# EAGLE design Task10-1D (EAGLE 9.3.0)

## Sheet 1 of 5: Microcontroller
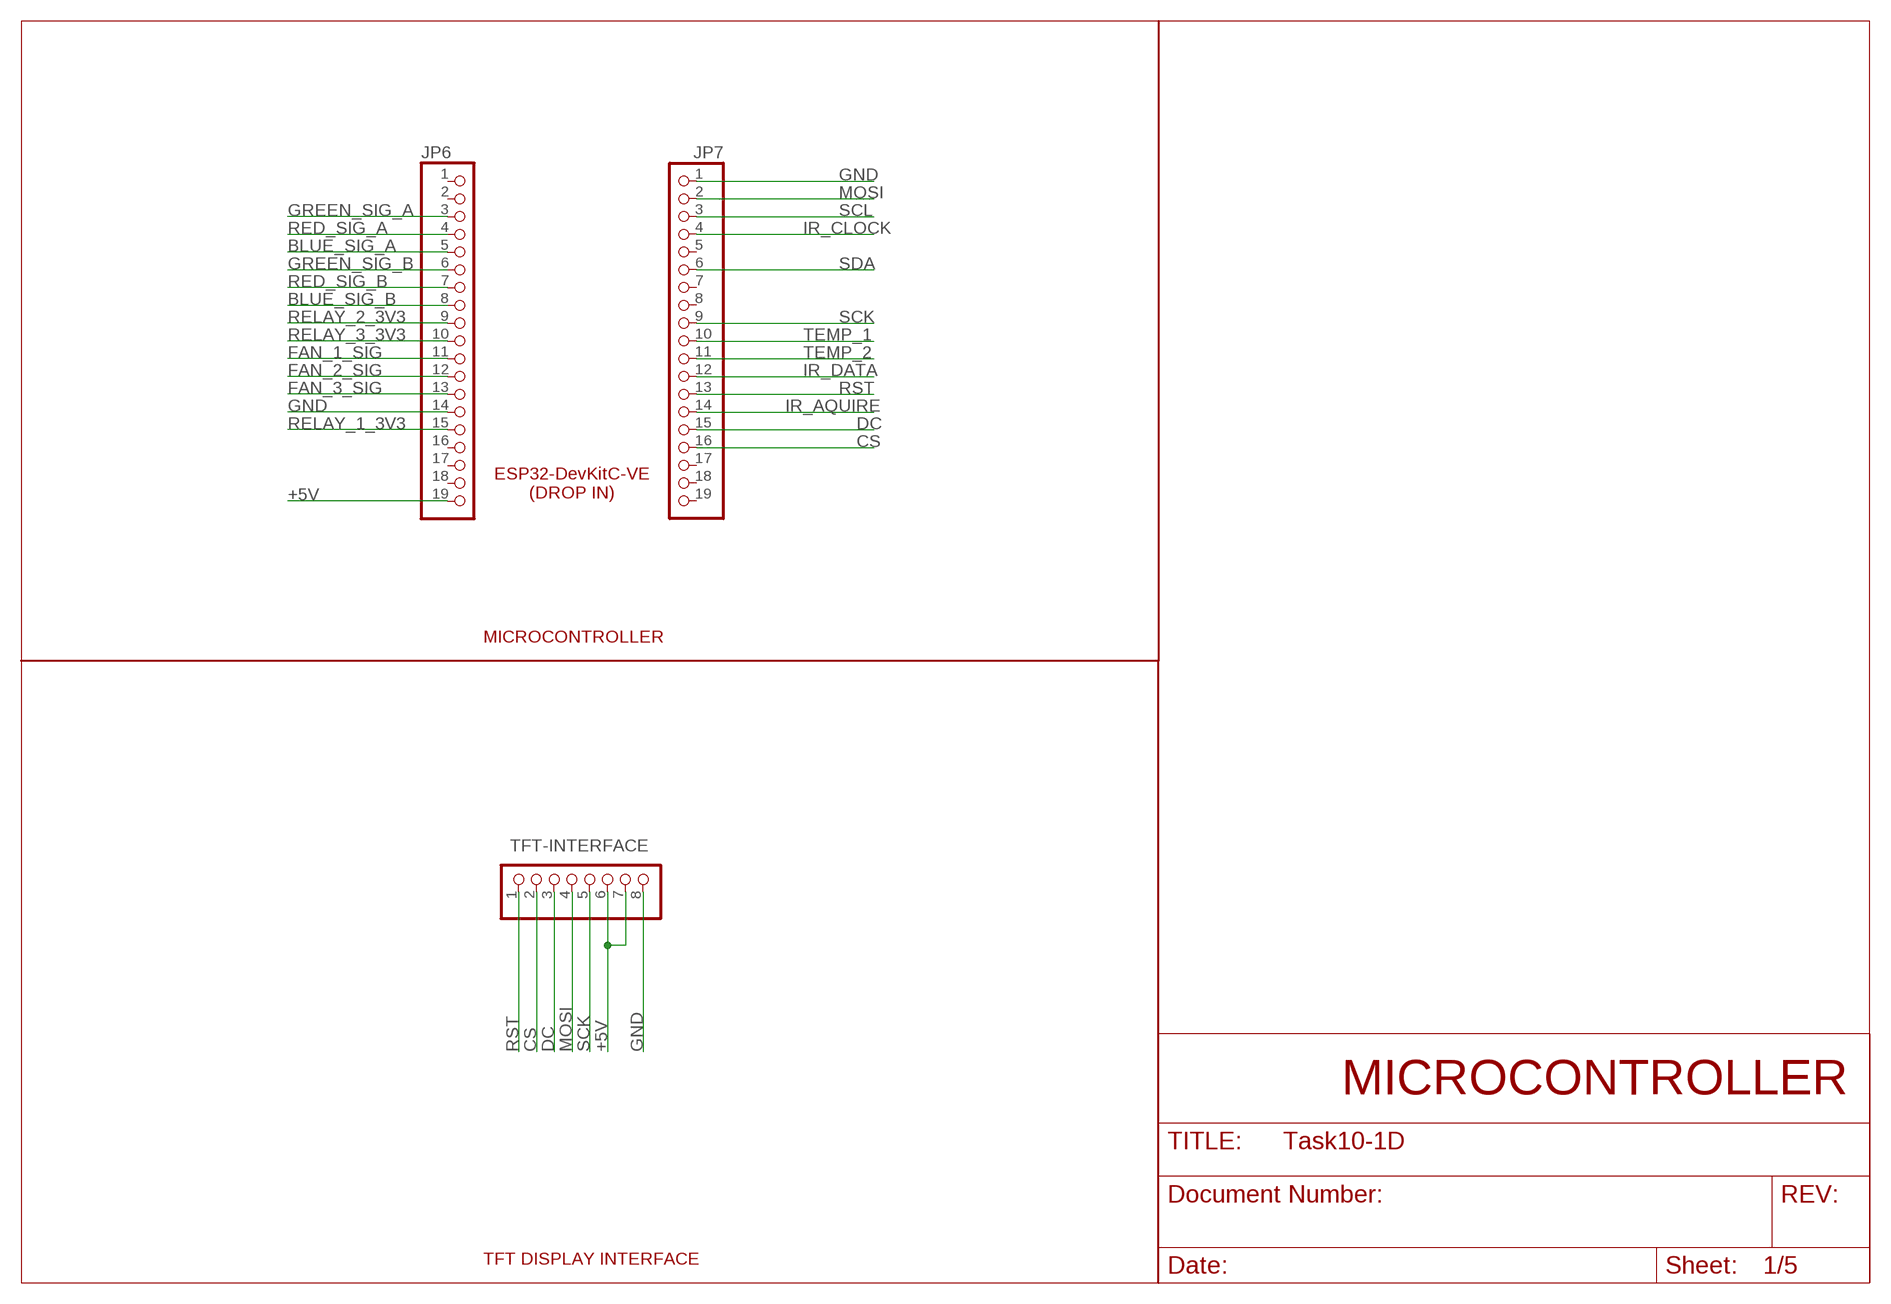
[diagram p0: schematic, sheet 1]

### Parts
JP6  PINHD-1X19  [1X19]
JP7  PINHD-1X19  [1X19]
TFT-INTERFACE  PINHD-1X8  [1X08]

### Nets
+5V: JP6.19 TFT-INTERFACE.6 TFT-INTERFACE.7 ; also sheet 2,5
BLUE_SIG_A: JP6.5 ; also sheet 4
BLUE_SIG_B: JP6.8 ; also sheet 4
CS: JP7.16 TFT-INTERFACE.2
DC: JP7.15 TFT-INTERFACE.3
FAN_1_SIG: JP6.11 ; also sheet 4
FAN_2_SIG: JP6.12 ; also sheet 4
FAN_3_SIG: JP6.13 ; also sheet 4
GND: JP6.14 JP7.1 TFT-INTERFACE.8 ; also sheet 2,3,4,5
GREEN_SIG_A: JP6.3 ; also sheet 4
GREEN_SIG_B: JP6.6 ; also sheet 4
IR_AQUIRE: JP7.14 ; also sheet 3
IR_CLOCK: JP7.4 ; also sheet 3
IR_DATA: JP7.12 ; also sheet 3
MOSI: JP7.2 TFT-INTERFACE.4
RED_SIG_A: JP6.4 ; also sheet 4
RED_SIG_B: JP6.7 ; also sheet 4
RELAY_1_3V3: JP6.15 ; also sheet 2
RELAY_2_3V3: JP6.9 ; also sheet 2
RELAY_3_3V3: JP6.10 ; also sheet 2
RST: JP7.13 TFT-INTERFACE.1
SCK: JP7.9 TFT-INTERFACE.5
SCL: JP7.3 ; also sheet 3
SDA: JP7.6 ; also sheet 3
TEMP_1: JP7.10 ; also sheet 3
TEMP_2: JP7.11 ; also sheet 3
Unconnected: JP6.1 JP6.2 JP6.16 JP6.17 JP6.18 JP7.5 JP7.7 JP7.8 JP7.17 JP7.18 JP7.19

### Notes on the sheet
- ESP32-DevKitC-VE
  (DROP IN)
- MICROCONTROLLER
- MICROCONTROLLER
- TFT DISPLAY INTERFACE

## Sheet 2 of 5: Mains Power Switching
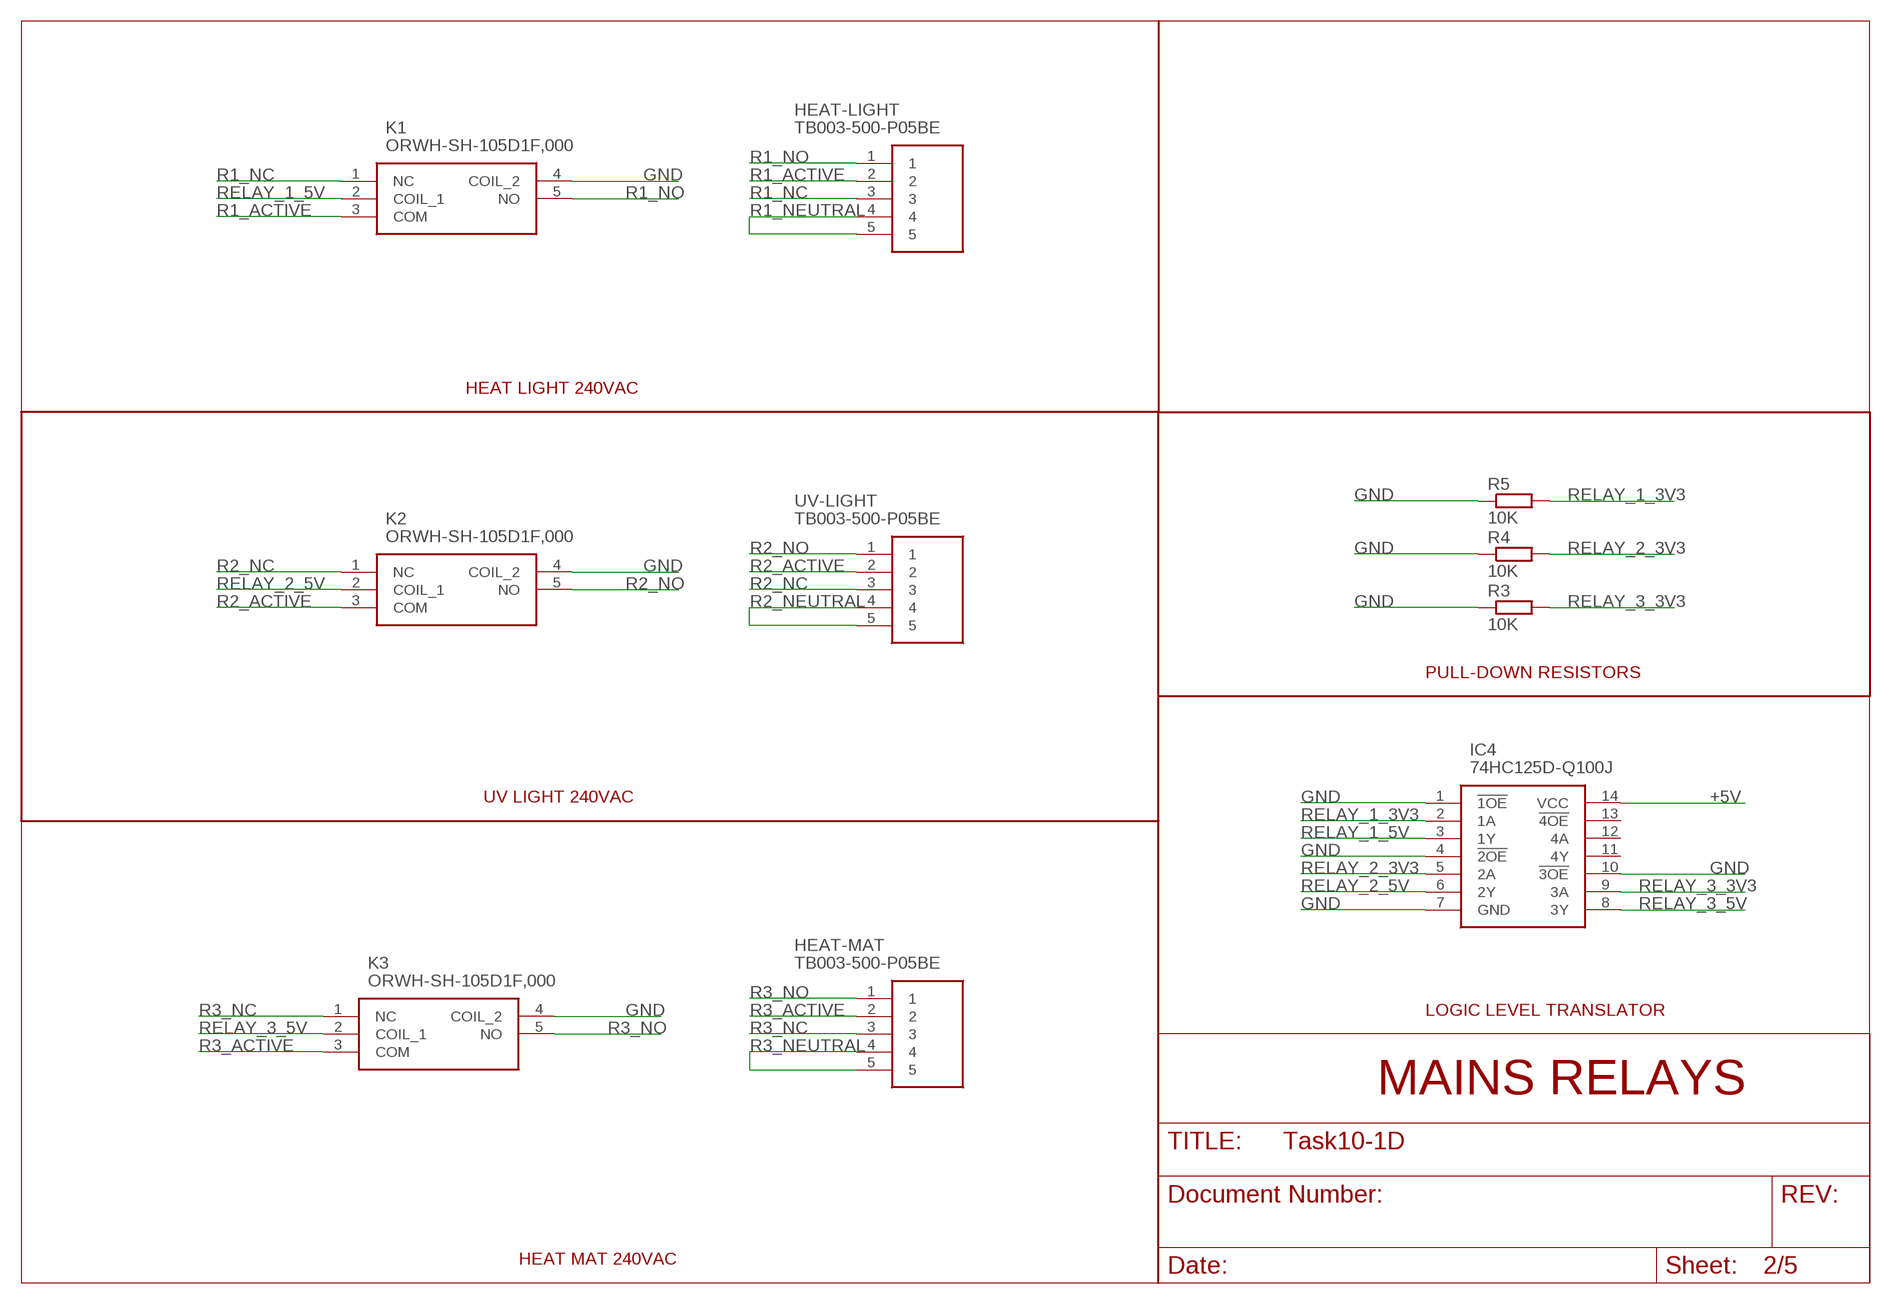
[diagram p1: schematic, sheet 2]

### Parts
HEAT-LIGHT  TB003-500-P05BE  [TB003500P05BE]
HEAT-MAT  TB003-500-P05BE  [TB003500P05BE]
IC4  74HC125D-Q100J  [SOIC127P600X175-14N]
K1  ORWH-SH-105D1F,000  [ORWH-1T]
K2  ORWH-SH-105D1F,000  [ORWH-1T]
K3  ORWH-SH-105D1F,000  [ORWH-1T]
R3  10K  R-EU_M0805  [M0805]
R4  10K  R-EU_M0805  [M0805]
R5  10K  R-EU_M0805  [M0805]
UV-LIGHT  TB003-500-P05BE  [TB003500P05BE]

### Nets
+5V: IC4.14(VCC) ; also sheet 1,5
GND: IC4.1(!1OE) IC4.4(!2OE) IC4.7(GND) IC4.10(!3OE) K1.4(COIL_2) K2.4(COIL_2) K3.4(COIL_2) R3.1 R4.1 R5.1 ; also sheet 1,3,4,5
R1_ACTIVE: HEAT-LIGHT.2 K1.3(COM)
R1_NC: HEAT-LIGHT.3 K1.1(NC)
R1_NEUTRAL: HEAT-LIGHT.4 HEAT-LIGHT.5
R1_NO: HEAT-LIGHT.1 K1.5(NO)
R2_ACTIVE: K2.3(COM) UV-LIGHT.2
R2_NC: K2.1(NC) UV-LIGHT.3
R2_NEUTRAL: UV-LIGHT.4 UV-LIGHT.5
R2_NO: K2.5(NO) UV-LIGHT.1
R3_ACTIVE: HEAT-MAT.2 K3.3(COM)
R3_NC: HEAT-MAT.3 K3.1(NC)
R3_NEUTRAL: HEAT-MAT.4 HEAT-MAT.5
R3_NO: HEAT-MAT.1 K3.5(NO)
RELAY_1_3V3: IC4.2(1A) R5.2 ; also sheet 1
RELAY_1_5V: IC4.3(1Y) K1.2(COIL_1)
RELAY_2_3V3: IC4.5(2A) R4.2 ; also sheet 1
RELAY_2_5V: IC4.6(2Y) K2.2(COIL_1)
RELAY_3_3V3: IC4.9(3A) R3.2 ; also sheet 1
RELAY_3_5V: IC4.8(3Y) K3.2(COIL_1)
Unconnected: IC4.11(4Y) IC4.12(4A) IC4.13(!4OE)

### Notes on the sheet
- HEAT LIGHT 240VAC
- PULL-DOWN RESISTORS
- UV LIGHT 240VAC
- LOGIC LEVEL TRANSLATOR
- MAINS RELAYS
- HEAT MAT 240VAC

## Sheet 3 of 5: Sensors
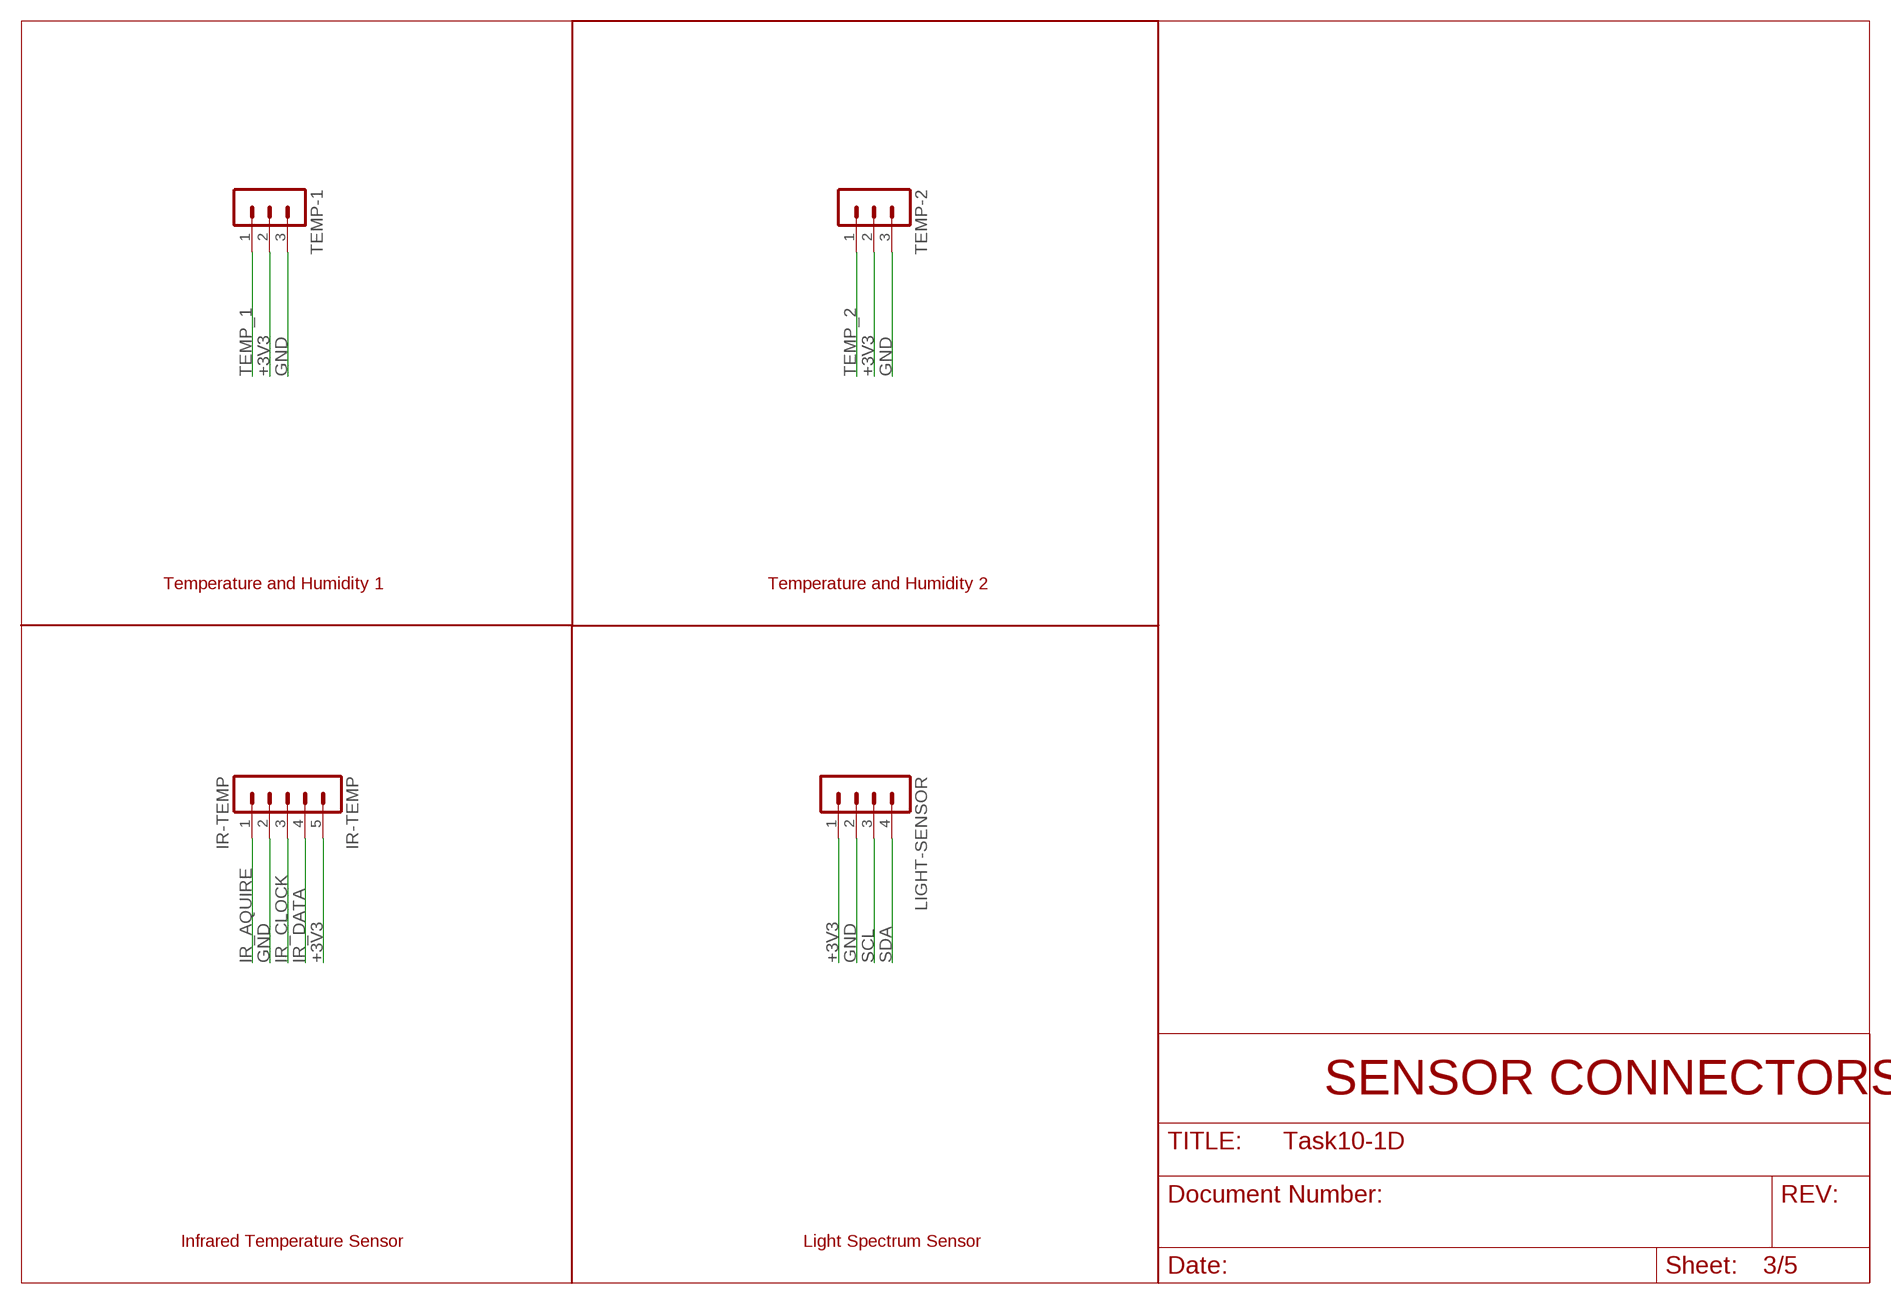
[diagram p2: schematic, sheet 3]

### Parts
IR-TEMP  IR-TEMP  MA05-1  [MA05-1]
LIGHT-SENSOR  MA04-1  [MA04-1]
TEMP-1  MA03-1  [MA03-1]
TEMP-2  MA03-1  [MA03-1]

### Nets
+3V3: IR-TEMP.5 LIGHT-SENSOR.1 TEMP-1.2 TEMP-2.2 ; also sheet 5
GND: IR-TEMP.2 LIGHT-SENSOR.2 TEMP-1.3 TEMP-2.3 ; also sheet 1,2,4,5
IR_AQUIRE: IR-TEMP.1 ; also sheet 1
IR_CLOCK: IR-TEMP.3 ; also sheet 1
IR_DATA: IR-TEMP.4 ; also sheet 1
SCL: LIGHT-SENSOR.3 ; also sheet 1
SDA: LIGHT-SENSOR.4 ; also sheet 1
TEMP_1: TEMP-1.1 ; also sheet 1
TEMP_2: TEMP-2.1 ; also sheet 1

### Notes on the sheet
- Temperature and Humidity 1 | Temperature and Humidity 2
- SENSOR CONNECTORS
- Infrared Temperature Sensor | Light Spectrum Sensor

## Sheet 4 of 5: Fan and LED Controllers
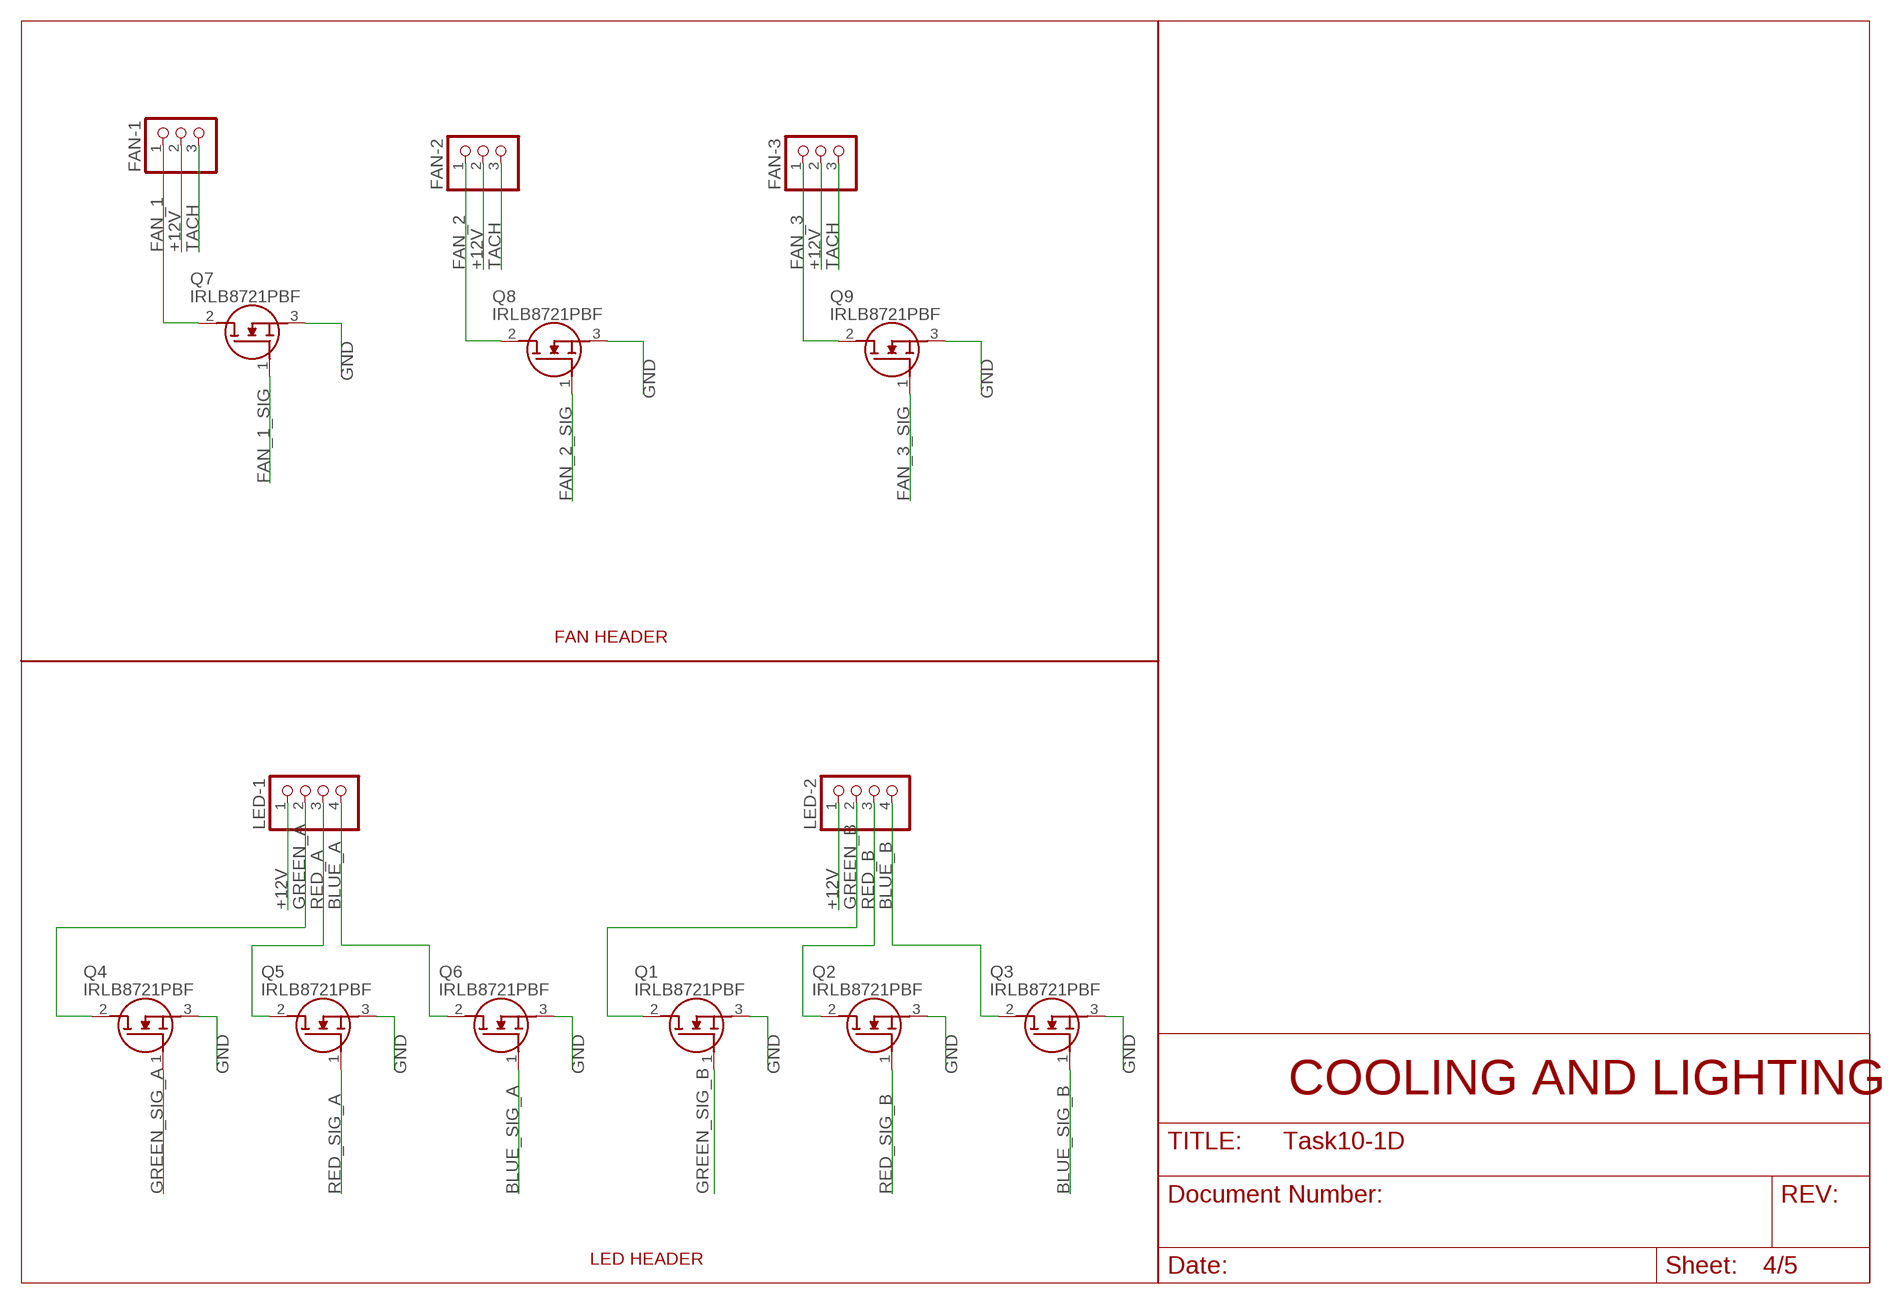
[diagram p3: schematic, sheet 4]

### Parts
FAN-1  PINHD-1X3  [1X03]
FAN-2  PINHD-1X3  [1X03]
FAN-3  PINHD-1X3  [1X03]
LED-1  PINHD-1X4  [1X04]
LED-2  PINHD-1X4  [1X04]
Q1  IRLB8721PBF  [TO254P483X1016X1994-3P]
Q2  IRLB8721PBF  [TO254P483X1016X1994-3P]
Q3  IRLB8721PBF  [TO254P483X1016X1994-3P]
Q4  IRLB8721PBF  [TO254P483X1016X1994-3P]
Q5  IRLB8721PBF  [TO254P483X1016X1994-3P]
Q6  IRLB8721PBF  [TO254P483X1016X1994-3P]
Q7  IRLB8721PBF  [TO254P483X1016X1994-3P]
Q8  IRLB8721PBF  [TO254P483X1016X1994-3P]
Q9  IRLB8721PBF  [TO254P483X1016X1994-3P]

### Nets
+12V: FAN-1.2 FAN-2.2 FAN-3.2 LED-1.1 LED-2.1 ; also sheet 5
BLUE_A: LED-1.4 Q6.2(D)
BLUE_B: LED-2.4 Q3.2(D)
BLUE_SIG_A: Q6.1(G) ; also sheet 1
BLUE_SIG_B: Q3.1(G) ; also sheet 1
FAN_1: FAN-1.1 Q7.2(D)
FAN_1_SIG: Q7.1(G) ; also sheet 1
FAN_2: FAN-2.1 Q8.2(D)
FAN_2_SIG: Q8.1(G) ; also sheet 1
FAN_3: FAN-3.1 Q9.2(D)
FAN_3_SIG: Q9.1(G) ; also sheet 1
GND: Q1.3(S) Q2.3(S) Q3.3(S) Q4.3(S) Q5.3(S) Q6.3(S) Q7.3(S) Q8.3(S) Q9.3(S) ; also sheet 1,2,3,5
GREEN_A: LED-1.2 Q4.2(D)
GREEN_B: LED-2.2 Q1.2(D)
GREEN_SIG_A: Q4.1(G) ; also sheet 1
GREEN_SIG_B: Q1.1(G) ; also sheet 1
RED_A: LED-1.3 Q5.2(D)
RED_B: LED-2.3 Q2.2(D)
RED_SIG_A: Q5.1(G) ; also sheet 1
RED_SIG_B: Q2.1(G) ; also sheet 1
TACH: FAN-1.3 FAN-2.3 FAN-3.3

### Notes on the sheet
- FAN HEADER
- COOLING AND LIGHTING
- LED HEADER

## Sheet 5 of 5: DC Power Delivery
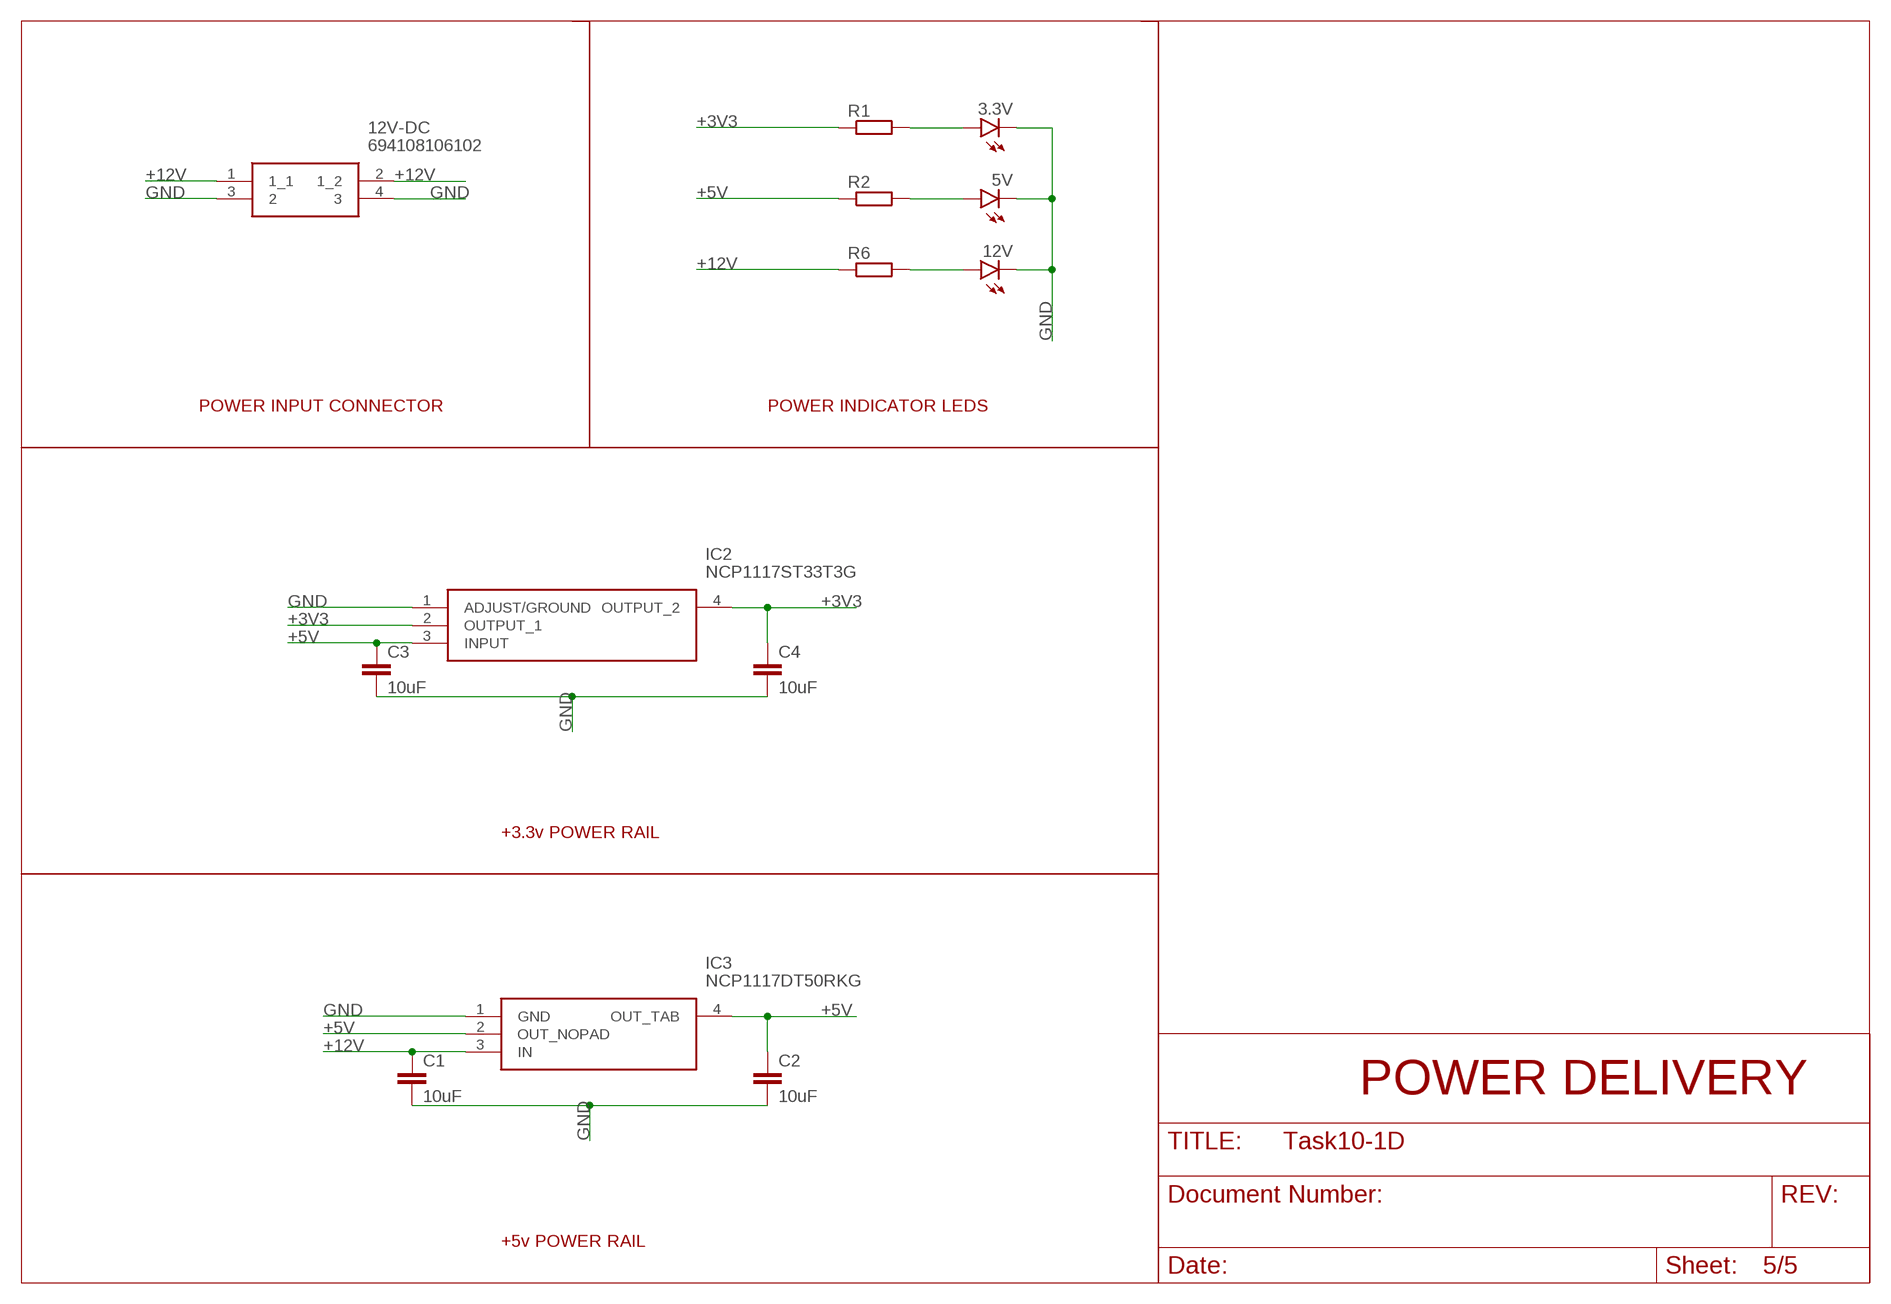
[diagram p4: schematic, sheet 5]

### Parts
3.3V  LEDCHIP-LED0805  [CHIP-LED0805]
5V  LEDCHIP-LED0805  [CHIP-LED0805]
12V  LEDCHIP-LED0805  [CHIP-LED0805]
12V-DC  694108106102  [694108106102]
C1  10uF  C-EUC0805  [C0805]
C2  10uF  C-EUC0805  [C0805]
C3  10uF  C-EUC0805  [C0805]
C4  10uF  C-EUC0805  [C0805]
IC2  NCP1117ST33T3G  [SOT230P700X180-4N]
IC3  NCP1117DT50RKG  [TO229P990X238-4N]
R1  R-EU_M0805  [M0805]
R2  R-EU_M0805  [M0805]
R6  R-EU_M0805  [M0805]

### Nets
+3V3: C4.1 IC2.2(OUTPUT_1) IC2.4(OUTPUT_2) R1.1 ; also sheet 3
+5V: C2.1 C3.1 IC2.3(INPUT) IC3.2(OUT_NOPAD) IC3.4(OUT_TAB) R2.1 ; also sheet 1,2
+12V: 12V-DC.1(1_1) 12V-DC.2(1_2) C1.1 IC3.3(IN) R6.1 ; also sheet 4
GND: 3.3V.C 5V.C 12V-DC.3 12V-DC.4 12V.C C1.2 C2.2 C3.2 C4.2 IC2.1(ADJUST/GROUND) IC3.1(GND) ; also sheet 1,2,3,4
N$1: 12V.A R6.2
N$2: 5V.A R2.2
N$3: 3.3V.A R1.2

### Notes on the sheet
- POWER INPUT CONNECTOR | POWER INDICATOR LEDS
- +3.3v POWER RAIL
- POWER DELIVERY
- +5v POWER RAIL

## Library data of the parts
3.3V 5V 12V = led:LED: LED OSRAM: - CHIPLED LG R971, LG N971, LY N971, LG Q971, LY Q971, LO R971, LY R971 LH N974, LH R974 LS Q976, LO Q976, LY Q976 LO Q996 - Hyper CHIPLED LW Q18S LB Q993, LB Q99A, LB R99A - SideLED LS A670, LO A670, LY A670, LG A670, LP A670 LB A673, LV A673, LT A673, LW A673 LH A674 LY A675 LS A676, LA A676, LO A676, LY A676, LW A676 LS A679, LY A679, LG A679 - Hyper Micro SIDELED® LS Y876, LA Y876, LO Y876, LY Y876 LT Y87S - SmartLED LW L88C, LW L88S LB L89C, LB L89S, LG L890 LS L89K, LO L89K, LY L89K LS L896, LA L896, LO L896, LY L896 - TOPLED LS T670, LO T670, LY T670, LG T670, LP T670 LSG T670, LSP T670, LSY T670, LOP T670, LYG T670 LG T671, LOG T671, LSG T671 LB T673, LV T673, LT T673, LW T673 LH T674 LS T676, LA T676, LO T676, LY T676, LB T676, LH T676, LSB T676, LW T676 LB T67C, LV T67C, LT T67C, LS T67K, LO T67K, LY T67K, LW E67C LS E67B, LA E67B, LO E67B, LY E67B, LB E67C, LV E67C, LT E67C LW T67C LS T679, LY T679, LG T679 LS T770, LO T770, LY T770, LG T770, LP T770 LB T773, LV T773, LT T773, LW T773 LH T774 LS E675, LA E675, LY E675, LS T675 LS T776, LA T776, LO T776, LY T776, LB T776 LHGB T686 LT T68C, LB T68C - Hyper Mini TOPLED® LB M676 - Mini TOPLED Santana® LG M470 LS M47K, LO M47K, LY M47K Source: http://www.osram.convergy.de LUXEON: - LUMILED® LXK2-PW12-R00, LXK2-PW12-S00, LXK2-PW14-U00, LXK2-PW14-V00 LXK2-PM12-R00, LXK2-PM12-S00, LXK2-PM14-U00 LXK2-PE12-Q00, LXK2-PE12-R00, LXK2-PE12-S00, LXK2-PE14-T00, LXK2-PE14-U00 LXK2-PB12-K00, LXK2-PB12-L00, LXK2-PB12-M00, LXK2-PB14-N00, LXK2-PB14-P00, LXK2-PB14-Q00 LXK2-PR12-L00, LXK2-PR12-M00, LXK2-PR14-Q00, LXK2-PR14-R00 LXK2-PD12-Q00, LXK2-PD12-R00, LXK2-PD12-S00 LXK2-PH12-R00, LXK2-PH12-S00 LXK2-PL12-P00, LXK2-PL12-Q00, LXK2-PL12-R00 Source: www.luxeon.com KINGBRIGHT: KA-3528ASYC Source: www.kingbright.com
12V-DC = 694108106102:694108106102: WURTH ELEKTRONIK - 694108106102 - CONNECTOR, POWER ENTRY, JACK, 5A, 24VDC Source: Datasheet <http://katalog.we-online.de/em/datasheet/6941xx106102.pdf>; DESCRIPTION: WURTH ELEKTRONIK - 694108106102 - CONNECTOR, POWER ENTRY, JACK, 5A, 24VDC; HEIGHT: 11mm; MANUFACTURER_NAME: Wurth Elektronik; MANUFACTURER_PART_NUMBER: 694108106102; MOUSER_PART_NUMBER: 710-694108106102; MOUSER_PRICE-STOCK: https://www.mouser.co.uk/ProductDetail/Wurth-Elektronik/694108106102/?qs=a9WhcLg8qCwOtilTS%252B%2FAyw%3D%3D
C1-C4 = rcl:C-EU: CAPACITOR, European symbol; SPICEPREFIX: C
FAN-1-FAN-3 = pinhead:PINHD-1X3: PIN HEADER
HEAT-LIGHT HEAT-MAT UV-LIGHT = TB003-500-P05BE:TB003-500-P05BE: Fixed Terminal Blocks screw type, 5.00 , horizontal, 5 poles, CUI Blue, Philip's head screw, PCB mount Source: Datasheet <https://www.cui.com/product/resource/tb003-500.pdf>; ARROW_PART_NUMBER: TB003-500-P05BE; ARROW_PRICE-STOCK: https://www.arrow.com/en/products/tb003-500-p05be/cui-devices; DESCRIPTION: Fixed Terminal Blocks screw type, 5.00 , horizontal, 5 poles, CUI Blue, Philip's head screw, PCB mount; HEIGHT: 10.7mm; MANUFACTURER_NAME: CUI Inc.; MANUFACTURER_PART_NUMBER: TB003-500-P05BE; MOUSER_PART_NUMBER: 490-TB003-500-P05BE; MOUSER_PRICE-STOCK: https://www.mouser.co.uk/ProductDetail/CUI-Devices/TB003-500-P05BE?qs=vLWxofP3U2xXm4XKOMROaw%3D%3D
IC2 = NCP1117ST33T3G:NCP1117ST33T3G: ON SEMICONDUCTOR - NCP1117ST33T3G - IC, LINEAR VOLTAGE REGULATOR Source: Datasheet <http://www.onsemi.com/pub/Collateral/NCP1117-D.PDF>; ARROW_PART_NUMBER: NCP1117ST33T3G; ARROW_PRICE-STOCK: https://www.arrow.com/en/products/ncp1117st33t3g/on-semiconductor; DESCRIPTION: ON SEMICONDUCTOR - NCP1117ST33T3G - IC, LINEAR VOLTAGE REGULATOR; HEIGHT: 1.8mm; MANUFACTURER_NAME: ON Semiconductor; MANUFACTURER_PART_NUMBER: NCP1117ST33T3G; MOUSER_PART_NUMBER: 863-NCP1117ST33T3G; MOUSER_PRICE-STOCK: https://www.mouser.co.uk/ProductDetail/ON-Semiconductor/NCP1117ST33T3G/?qs=Gev%252BmEvV0iZb%2FE8ahUDx3w%3D%3D
IC3 = NCP1117DT50RKG:NCP1117DT50RKG: Source: Datasheet <http://www.onsemi.com/pub/Collateral/NCP1117-D.PDF>; ARROW_PART_NUMBER: NCP1117DT50RKG; ARROW_PRICE-STOCK: https://www.arrow.com/en/products/ncp1117dt50rkg/on-semiconductor; HEIGHT: 2.38mm; MANUFACTURER_NAME: ON Semiconductor; MANUFACTURER_PART_NUMBER: NCP1117DT50RKG; MOUSER_PART_NUMBER: 863-NCP1117DT50RKG; MOUSER_PRICE-STOCK: https://www.mouser.co.uk/ProductDetail/ON-Semiconductor/NCP1117DT50RKG?qs=Gev%252BmEvV0iaGLyZQ1w6kFw%3D%3D
IC4 = 74HC125D-Q100J:74HC125D-Q100J: 74HC(T)125-Q100 - Quad buffer/line driver; 3-state@en-us Source: Datasheet <https://assets.nexperia.com/documents/data-sheet/74HC_HCT125_Q100.pdf>; ARROW_PART_NUMBER: 74HC125D-Q100J; ARROW_PRICE-STOCK: https://www.arrow.com/en/products/74hc125d-q100j/nexperia; DESCRIPTION: 74HC(T)125-Q100 - Quad buffer/line driver; 3-state@en-us; HEIGHT: 1.75mm; MANUFACTURER_NAME: Nexperia; MANUFACTURER_PART_NUMBER: 74HC125D-Q100J; MOUSER_PART_NUMBER: 771-74HC125D-Q100J; MOUSER_PRICE-STOCK: https://www.mouser.co.uk/ProductDetail/Nexperia/74HC125D-Q100J?qs=5XOdhvmYM0MidNKBhQVhGg%3D%3D
IR-TEMP = con-lstb:MA05-1: PIN HEADER; OC_FARNELL: unknown; OC_NEWARK: unknown
JP6 JP7 = pinhead:PINHD-1X19: PIN HEADER
K1-K3 = ORWH-SH-105D1F_000:ORWH-SH-105D1F,000: TE CONNECTIVITY - ORWH-SH-105D1F,000 - RELAY, SPDT, 277VAC, 28VDC, 10A Source: Datasheet <https://www.te.com/commerce/DocumentDelivery/DDEController?Action=showdoc&DocId=Data SheetORWH_series_relay_data_sheet_E0918pdfEnglishENG_DS_ORWH_series_relay_data_sheet_E_0918.pdf1-1721150-0>; ARROW_PART_NUMBER: ORWH-SH-105D1F,000; ARROW_PRICE-STOCK: https://www.arrow.com/en/products/orwh-sh-105d1f000/te-connectivity; DESCRIPTION: TE CONNECTIVITY - ORWH-SH-105D1F,000 - RELAY, SPDT, 277VAC, 28VDC, 10A; HEIGHT: mm; MANUFACTURER_NAME: TE Connectivity; MANUFACTURER_PART_NUMBER: ORWH-SH-105D1F,000; MOUSER_PART_NUMBER: 655-ORWH-SH105D1F000; MOUSER_PRICE-STOCK: https://www.mouser.co.uk/ProductDetail/TE-Connectivity/ORWH-SH-105D1F000?qs=rXmh1mW8ce3c0xxgCCx3sA%3D%3D
LED-1 LED-2 = pinhead:PINHD-1X4: PIN HEADER
LIGHT-SENSOR = con-lstb:MA04-1: PIN HEADER; OC_FARNELL: unknown; OC_NEWARK: unknown
Q1-Q9 = IRLB8721PBF:IRLB8721PBF: Infineon IRLB8721PBF N-Channel MOSFET, 62 A, 30 V HEXFET, 3-Pin TO-220AB Source: Datasheet <http://uk.rs-online.com/web/p/products/7259322>; ARROW_PART_NUMBER: IRLB8721PBF; ARROW_PRICE-STOCK: https://www.arrow.com/en/products/irlb8721pbf/infineon-technologies-ag; DESCRIPTION: Infineon IRLB8721PBF N-Channel MOSFET, 62 A, 30 V HEXFET, 3-Pin TO-220AB; HEIGHT: 4.83mm; MANUFACTURER_NAME: Infineon; MANUFACTURER_PART_NUMBER: IRLB8721PBF; MOUSER_PART_NUMBER: 942-IRLB8721PBF; MOUSER_PRICE-STOCK: https://www.mouser.co.uk/ProductDetail/Infineon-IR/IRLB8721PBF?qs=9%252BKlkBgLFf0T58WYx%2FAl5A%3D%3D
R1-R6 = rcl:R-EU_: RESISTOR, European symbol; SPICEPREFIX: R
TEMP-1 TEMP-2 = con-lstb:MA03-1: PIN HEADER; OC_FARNELL: unknown; OC_NEWARK: unknown
TFT-INTERFACE = pinhead:PINHD-1X8: PIN HEADER

## Board
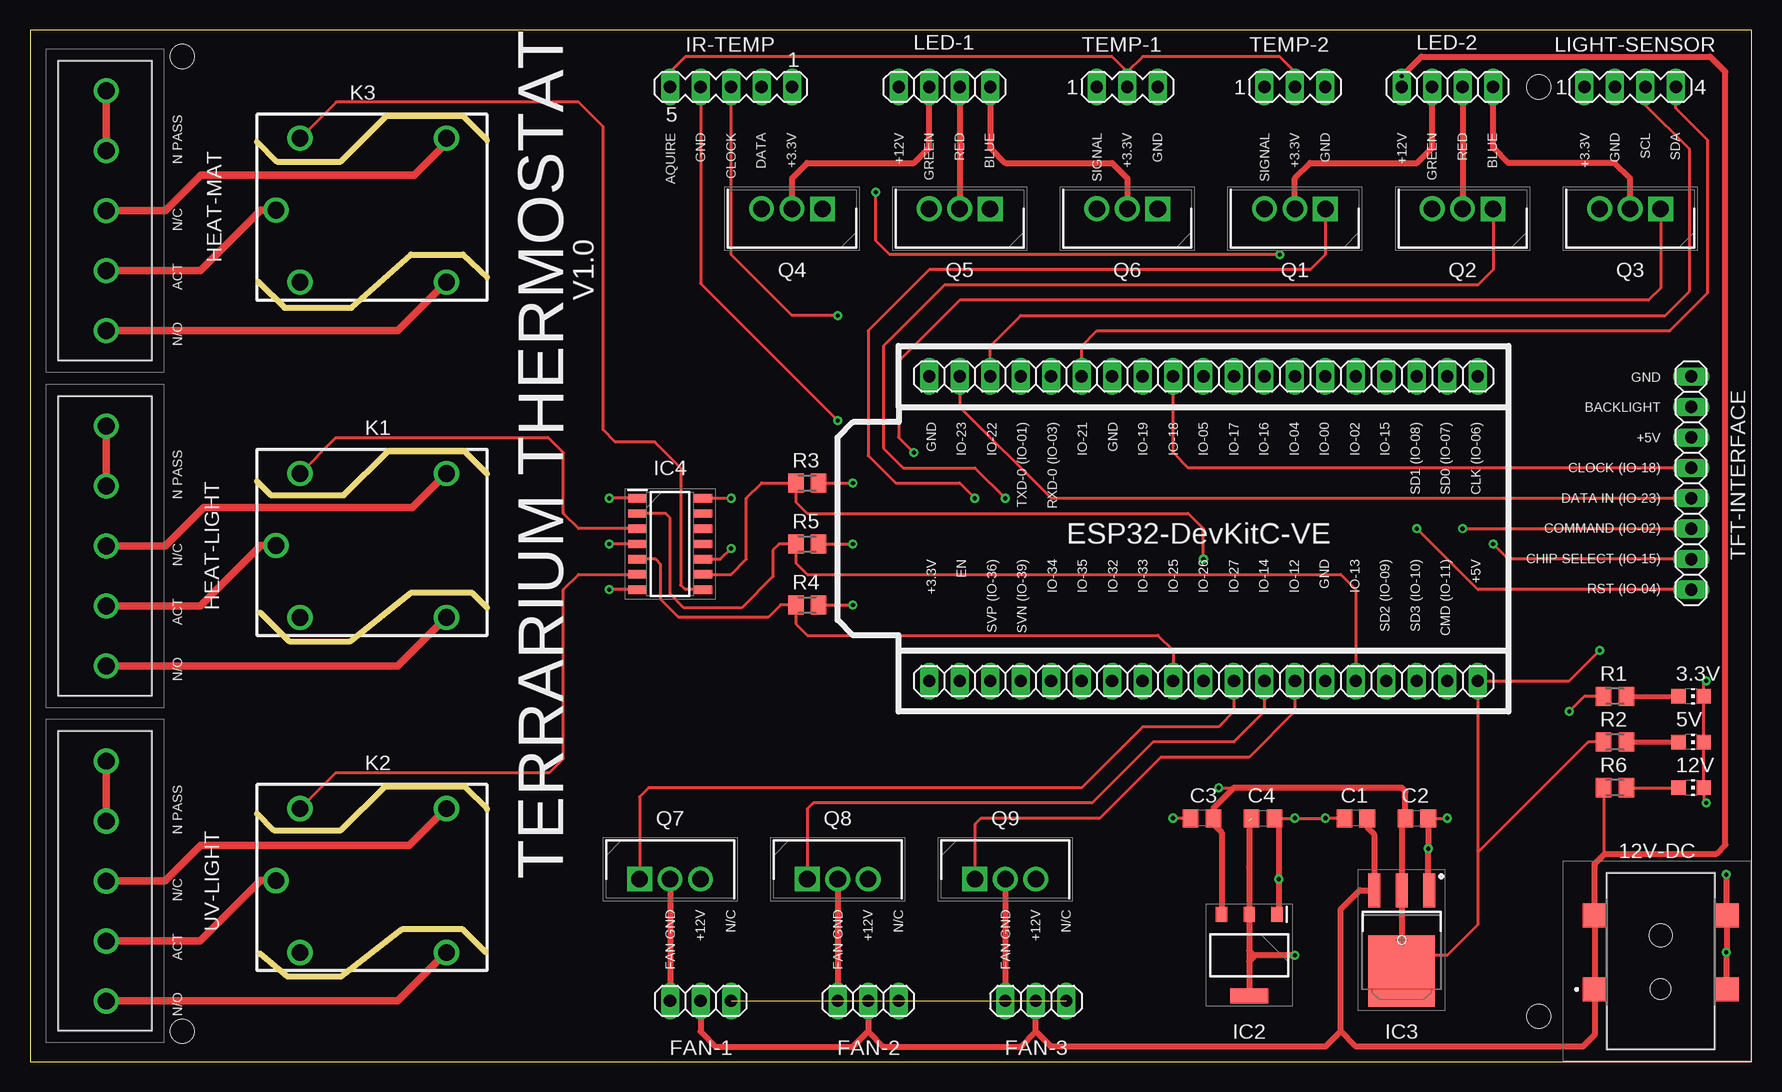
[diagram p5: board, top side]
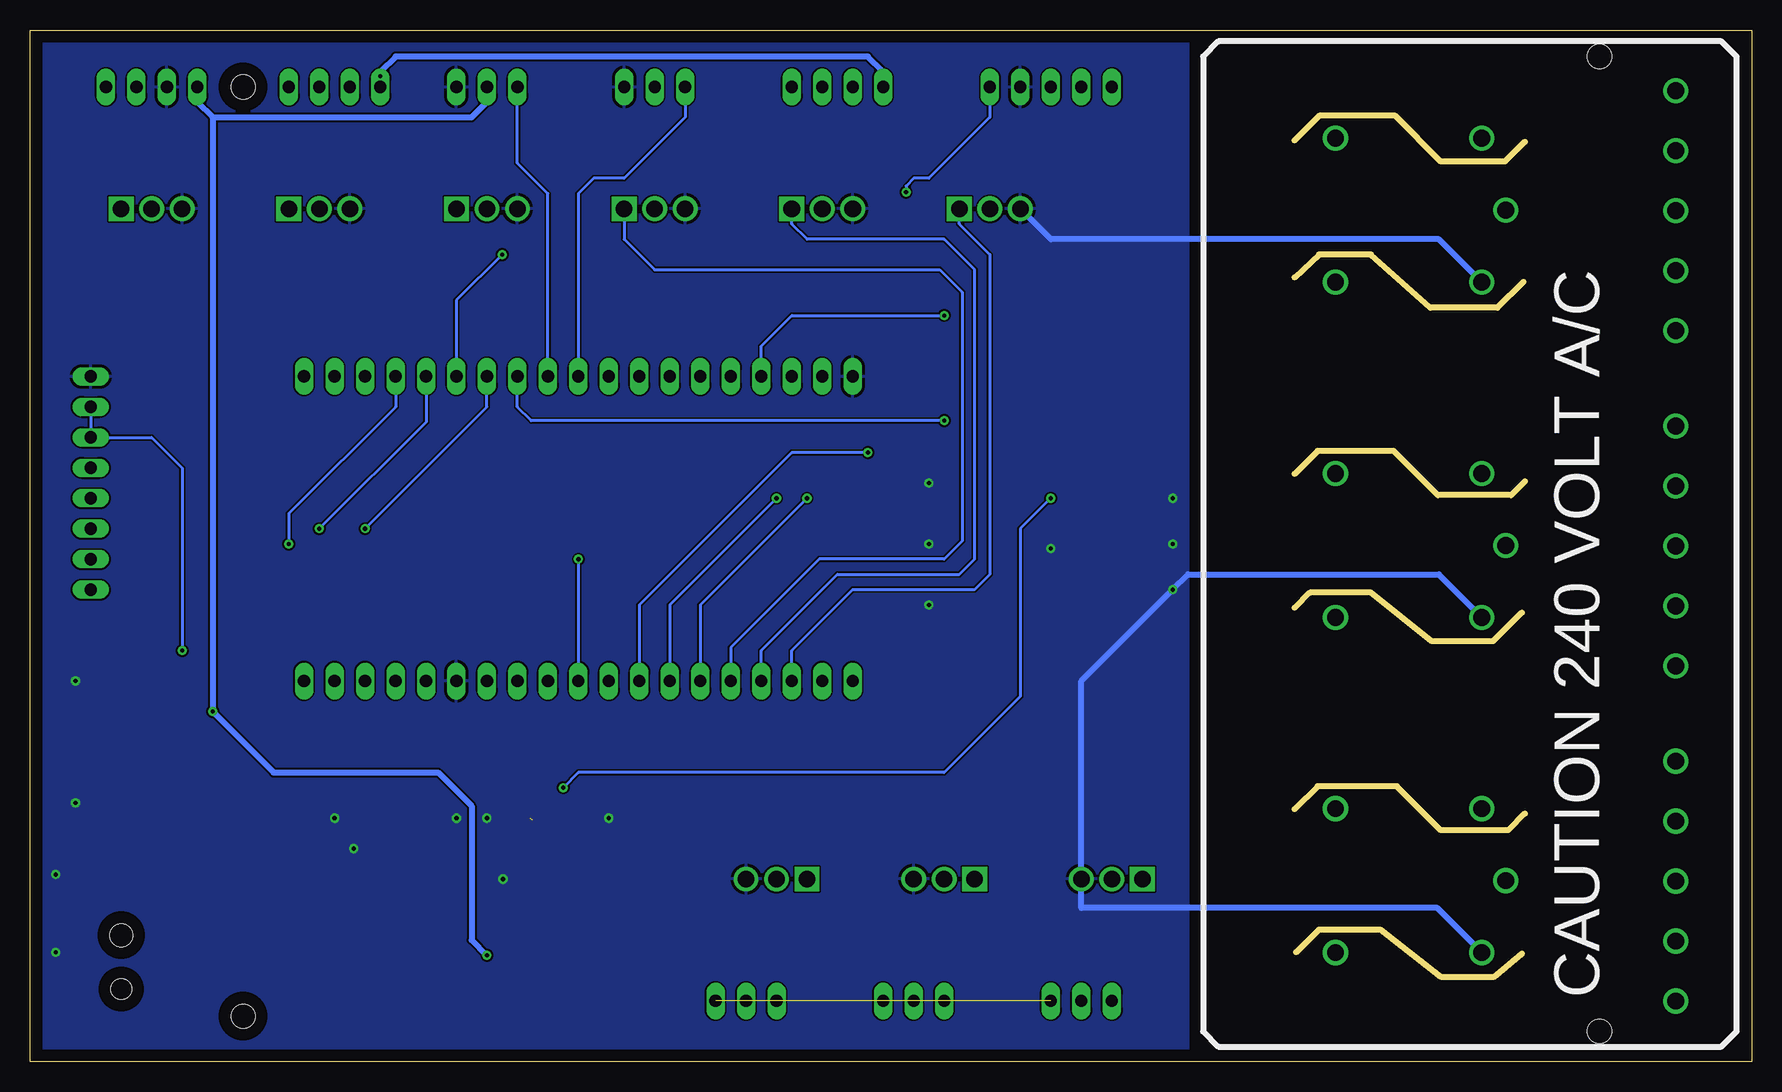
[diagram p6: board, bottom side, seen from below]

Size 143.49 x 86.03 mm. Coordinates in mm from the lower left corner, seen from the top.
Outline: 0,0 143.49,0 143.49,86.03 0,86.03 0,0
Copper layers (1*16): Top 0.035mm / dielectric 1.5mm / Bottom 0.035mm
Design rules "default": minimum track width 6mil, minimum drill 0.35mm, track to track 6mil, track to pad 6mil, pad to pad 6mil, via to via 6mil, smd to smd 6mil, copper to edge 40mil, drill to drill 6mil, minimum pad ring 10mil, minimum via ring 8mil, stop-mask expansion 4mil, vias tented up to drill 0mil, thermal gap 10mil
Holes 2 mm at 12.7,83.82 12.7,2.54 125.73,3.81 125.73,81.28
Milling: 30 lines

### Footprints (pad centres in the part's own frame; a part is rotated, then mirrored left to right if it is on the bottom)
CHIP-LED0805 = smd 1.2 x 1.2: A 0,-1.05; C 0,1.05
694108106102 = smd 2 x 2: 1 -3.075,5.5; 2 3.075,5.5; 3 -3.075,-5.5; 4 3.075,-5.5 | hole 1.7: -3.075,0 | hole 1.9: 1.425,0
C0805 = smd 1.3 x 1.5: 1 -0.95,0; 2 0.95,0
1X03 = drill 1.016 long: 1 -2.54,0; 2 0,0; 3 2.54,0
TB003500P05BE = drill 1.4 pad 2.1: 1 0,0; 2 5,0; 3 10,0; 4 15,0; 5 20,0
SOT230P700X180-4N = smd 1.25 x 0.95: 1 -3.4,2.3; 2 -3.4,0; 3 -3.4,-2.3 | smd 1.25 x 3.2: 4 3.4,0
TO229P990X238-4N = smd 2.85 x 1: 1 -4.15,2.29; 2 -4.15,0; 3 -4.15,-2.29 | smd 5.95 x 5.55: 4 2.6,0
SOIC127P600X175-14N = smd 1.55 x 0.7: 1 -2.725,3.81; 2 -2.725,2.54; 3 -2.725,1.27; 4 -2.725,0; 5 -2.725,-1.27; 6 -2.725,-2.54; 7 -2.725,-3.81; 8 2.725,-3.81; 9 2.725,-2.54; 10 2.725,-1.27; 11 2.725,0; 12 2.725,1.27; 13 2.725,2.54; 14 2.725,3.81
MA05-1 = drill 1.016 long: 1 -5.08,0; 2 -2.54,0; 3 0,0; 4 2.54,0; 5 5.08,0
1X19 = drill 1.016 long: 1 -22.86,0; 2 -20.32,0; 3 -17.78,0; 4 -15.24,0; 5 -12.7,0; 6 -10.16,0; 7 -7.62,0; 8 -5.08,0; 9 -2.54,0; 10 0,0; 11 2.54,0; 12 5.08,0; 13 7.62,0; 14 10.16,0; 15 12.7,0; 16 15.24,0; 17 17.78,0; 18 20.32,0; 19 22.86,0
ORWH-1T = drill 1.4 pad 2.1: 1 3.4,-13.5; 2 15.6,-13.5; 3 17.6,-7.5; 4 15.6,-1.5; 5 3.4,-1.5
1X04 = drill 1.016 long: 1 -3.81,0; 2 -1.27,0; 3 1.27,0; 4 3.81,0
MA04-1 = drill 1.016 long: 1 -3.81,0; 2 -1.27,0; 3 1.27,0; 4 3.81,0
TO254P483X1016X1994-3P = drill 1.38 pad 2.07 square: 1 0,0 | drill 1.38 pad 2.07: 2 2.54,0; 3 5.08,0
M0805 = smd 1.3 x 1.6: 1 -0.95,0; 2 0.95,0
MA03-1 = drill 1.016 long: 1 -2.54,0; 2 0,0; 3 2.54,0
1X08 = drill 1.016 long: 1 -8.89,0; 2 -6.35,0; 3 -3.81,0; 4 -1.27,0; 5 1.27,0; 6 3.81,0; 7 6.35,0; 8 8.89,0

### Placement (x,y rotation side)
3.3V  138.43,30.48 270 top
5V  138.43,26.67 270 top
12V  138.43,22.86 270 top
12V-DC  135.89,9.14 90 top
C1  110.49,20.32 180 top
C2  115.57,20.32 0 top
C3  97.66,20.32 180 top
C4  102.74,20.32 0 top
FAN-1  55.88,5.08 0 top
FAN-2  69.85,5.08 0 top
FAN-3  83.82,5.08 0 top
HEAT-LIGHT  6.35,33.02 90 top
HEAT-MAT  6.35,60.96 90 top
IC2  101.6,8.89 270 top
IC3  114.3,10.16 270 top
IC4  53.34,43.18 0 top
IR-TEMP  58.42,81.28 180 top
JP6  97.79,31.75 0 top
JP7  97.79,57.15 0 top
K1  38.1,35.56 180 top
K2  38.1,7.62 180 top
K3  38.1,63.5 180 top
LED-1  76.2,81.28 0 top
LED-2  118.11,81.28 0 top
LIGHT-SENSOR  133.35,81.28 0 top
Q1  107.95,71.12 180 top
Q2  121.92,71.12 180 top
Q3  135.89,71.12 180 top
Q4  66.04,71.12 180 top
Q5  80.01,71.12 180 top
Q6  93.98,71.12 180 top
Q7  50.8,15.24 0 top
Q8  64.77,15.24 0 top
Q9  78.74,15.24 0 top
R1  132.08,30.48 0 top
R2  132.08,26.67 0 top
R3  64.77,48.26 180 top
R4  64.77,38.1 180 top
R5  64.77,43.18 180 top
R6  132.08,22.86 0 top
TEMP-1  91.44,81.28 0 top
TEMP-2  105.41,81.28 0 top
TFT-INTERFACE  138.43,48.26 90 top
UV-LIGHT  6.35,5.08 90 top

### Tracks (layer width: path | path; a pad name or v marks a point on that pad's centre or on a via)
+3V3  (via drill 0.35)  (1 unrouted)
  Top 0.254: R1.1 129.54,30.48 v128.27,29.21 | 101.73,16.38 101.6,16.26 | TEMP-2.2 105.41,82.55 104.14,83.82 92.71,83.82 91.44,82.55 | TEMP-1.2 91.44,82.55 | 91.44,82.55 90.17,83.82 54.61,83.82 53.34,82.55 IR-TEMP.5
  Top 0.508: 101.6,20.13 101.6,16.26 IC2.2 101.6,9.27 | 101.6,9.27 101.6,8.38 | 101.6,8.38 IC2.4 | v105.41,8.89 102.11,8.89 | 102.11,8.89 101.6,8.38 | 102.11,8.89 101.98,8.89 101.6,9.27
  Bottom 0.508: LIGHT-SENSOR.1 129.54,80.01 128.27,78.74 | 128.27,78.74 106.68,78.74 105.41,80.01 TEMP-2.2 | 128.27,78.74 v128.27,29.21 123.19,24.13 109.47,24.13 106.68,21.34 106.68,10.16 v105.41,8.89
+5V  (via drill 0.35)
  Top 0.254: IC4.14 v58.42,46.99 | v99.06,22.86 100.33,22.86 | 114.3,8.89 118.11,8.89 120.65,11.43 120.65,17.46 | 120.65,17.46 JP6.19 128.27,31.75 v130.81,34.29 | R2.1 129.86,26.67 120.65,17.46
  Top 0.508: IC2.3 99.3,19.15 98.61,19.84 C3.1 98.61,21.14 100.33,22.86 114.3,22.86 114.62,22.54 C2.1 114.3,20 IC3.2 114.3,8.89 IC3.4
  Bottom 0.254: TFT-INTERFACE.7 TFT-INTERFACE.6 133.35,52.07 130.81,49.53 v130.81,34.29 | v58.42,46.99 60.96,44.45 60.96,30.48 67.31,24.13 97.79,24.13 v99.06,22.86
+12V  (via drill 0.35)
  Top 0.254: R6.1 131.13,17.46 131.24,17.36
  Top 0.508: C1.1 111.44,19.56 112.01,18.99 IC3.3 110.83,14.31 109.22,12.7 109.22,2.54 | 109.22,2.54 110.49,1.27 129.4,1.27 130.39,2.26 12V-DC.1 12V-DC.2 130.39,16.51 131.24,17.36 140.54,17.36 141.29,18.1 141.29,82.55 140.02,83.82 115.95,83.82 v114.3,82.17 | 109.22,2.54 107.95,1.27 85.09,1.27 83.82,2.54 | 83.82,2.54 FAN-3.2 | FAN-1.2 55.88,2.54 57.15,1.27 68.58,1.27 69.85,2.54 | FAN-2.2 69.85,2.54 | 69.85,2.54 71.12,1.27 82.55,1.27 83.82,2.54
  Bottom 0.508: LED-1.1 72.39,82.55 73.66,83.82 113.03,83.82 114.3,82.55 v114.3,82.17 LED-2.1
BLUE_A
  Top 0.508: Q6.2 91.44,73.66 90.17,74.93 81.28,74.93 80.01,76.2 LED-1.4
BLUE_B
  Top 0.508: LED-2.4 121.92,76.2 123.19,74.93 132.08,74.93 133.35,73.66 Q3.2
BLUE_SIG_A
  Bottom 0.254: Q6.1 93.98,68.58 91.44,66.04 67.69,66.04 65.81,64.16 65.81,43.41 67.31,41.91 77.72,41.91 85.09,34.54 JP6.5
BLUE_SIG_B  (via drill 0.35)
  Top 0.254: Q3.1 135.89,64.52 134.87,63.5 77.47,63.5 72.39,58.42 72.39,52.07 v73.66,50.8
  Bottom 0.254: v73.66,50.8 80.01,50.8 92.71,38.1 JP6.8
CS  (via drill 0.35)
  Top 0.254: TFT-INTERFACE.2 123.19,41.91 v121.92,43.18
  Bottom 0.254: JP7.16 113.03,54.61 121.92,45.72 v121.92,43.18
DC  (via drill 0.35)
  Top 0.254: v119.38,44.45 TFT-INTERFACE.3
  Bottom 0.254: JP7.15 110.49,53.34 v119.38,44.45
FAN_1
  Top 0.508: Q7.2 FAN-1.1
FAN_1_SIG
  Top 0.254: JP6.11 100.33,29.21 99.06,27.94 92.71,27.94 87.63,22.86 51.56,22.86 50.8,22.1 Q7.1
FAN_2
  Top 0.508: Q8.2 FAN-2.1
FAN_2_SIG
  Top 0.254: JP6.12 102.87,29.21 100.33,26.67 93.6,26.67 88.52,21.59 65.28,21.59 64.77,21.08 Q8.1
FAN_3
  Top 0.508: Q9.2 FAN-3.1
FAN_3_SIG
  Top 0.254: JP6.13 105.41,29.21 101.6,25.4 94.23,25.4 89.15,20.32 79.25,20.32 78.74,19.81 Q9.1
GND  (via drill 0.35)
  Top 0.254: R4.1 v68.58,38.1 | R5.1 v68.58,43.18 | R3.1 v68.58,48.26 | IC4.1 v48.26,46.99 | IC4.7 v48.26,39.37 | IC4.4 v48.26,43.18 | IC4.10 57.53,41.91 v58.42,42.8 | C3.2 v95.25,20.32 | C1.2 v107.95,20.32 v105.41,20.32 C4.2 | C2.2 v118.11,20.32 | v139.7,21.59 139.48,21.81 12V.C 5V.C 3.3V.C 139.48,31.53 v139.7,31.75
  Top 0.508: C2.2 v116.52,17.78 116.52,14.38 IC3.1 | C4.2 104.07,19.94 v104.07,15.24 104.07,12.46 IC2.1 | 12V-DC.3 141.39,9.11 | 141.39,9.11 v141.35,9.14 | 141.39,9.11 12V-DC.4 141.39,15.58 v141.35,15.62
  Bottom 0.508: K2.4 26.21,12.83 55.88,12.83 Q7.3 55.88,31.75 v48.26,39.37 46.99,40.64 26.08,40.64 K1.4 | K3.4 26.08,68.58 58.42,68.58 Q4.3
  pour Bottom: 46.99,86.36 143.51,86.36 143.51,0 46.99,0
GREEN_A
  Top 0.508: Q4.2 63.5,73.66 64.77,74.93 73.66,74.93 74.93,76.2 LED-1.2
GREEN_B
  Top 0.508: Q1.2 105.41,73.66 106.68,74.93 115.57,74.93 116.84,76.2 LED-2.2
GREEN_SIG_A
  Bottom 0.254: Q4.1 66.04,69.85 63.5,67.31 63.5,40.64 64.77,39.37 74.93,39.37 80.01,34.29 JP6.3
GREEN_SIG_B  (via drill 0.35)
  Top 0.254: Q1.1 107.95,67.31 106.68,66.04 74.93,66.04 69.85,60.96 69.85,50.55 72.14,48.26 77.47,48.26 v78.74,46.99
  Bottom 0.254: v78.74,46.99 87.63,38.1 JP6.6
IR_AQUIRE  (via drill 0.35)
  Top 0.254: v70.48,72.52 70.48,68.45 71.63,67.31 v104.14,67.31
  Bottom 0.254: v104.14,67.31 107.95,63.5 JP7.14 | IR-TEMP.1 63.5,78.74 68.58,73.66 69.85,73.66 70.48,73.03 v70.48,72.52
IR_CLOCK  (via drill 0.35)
  Top 0.254: IR-TEMP.3 58.42,67.31 63.5,62.23 v67.31,62.23
  Bottom 0.254: JP7.4 82.55,59.69 80.01,62.23 v67.31,62.23
IR_DATA  (via drill 0.35)
  Top 0.254: IR-TEMP.4 55.88,64.9 v67.31,53.47
  Bottom 0.254: v67.31,53.47 101.73,53.47 102.87,54.61 JP7.12
MOSI
  Top 0.254: JP7.2 77.47,54.61 85.09,46.99 TFT-INTERFACE.4
N$1
  Top 0.254: R6.2 12V.A
N$2
  Top 0.406: R2.2 5V.A
N$3
  Top 0.406: R1.2 3.3V.A
R1_ACTIVE
  Top 0.61: HEAT-LIGHT.2 14.19,38.02 19.23,43.06 K1.3
R1_NC
  Top 0.61: HEAT-LIGHT.3 11.27,43.02 14.48,46.23 31.87,46.23 K1.1
R1_NEUTRAL
  Top 0.61: HEAT-LIGHT.5 HEAT-LIGHT.4
R1_NO
  Top 0.61: HEAT-LIGHT.1 30.66,33.02 K1.5
R2_ACTIVE
  Top 0.61: UV-LIGHT.2 14.19,10.08 19.23,15.12 K2.3
R2_NC
  Top 0.61: UV-LIGHT.3 11.27,15.08 14.22,18.03 31.61,18.03 K2.1
R2_NEUTRAL
  Top 0.61: UV-LIGHT.5 UV-LIGHT.4
R2_NO
  Top 0.61: UV-LIGHT.1 30.66,5.08 K2.5
R3_ACTIVE
  Top 0.61: HEAT-MAT.2 14.19,65.96 19.23,71 K3.3
R3_NC
  Top 0.61: HEAT-MAT.3 11.27,70.96 14.22,73.91 32,73.91 34.7,76.61 K3.1
R3_NEUTRAL
  Top 0.61: HEAT-MAT.5 HEAT-MAT.4
R3_NO
  Top 0.61: HEAT-MAT.1 30.66,60.96 K3.5
RED_A
  Top 0.508: LED-1.3 Q5.2
RED_B
  Top 0.508: LED-2.3 Q2.2
RED_SIG_A
  Bottom 0.254: JP6.4 82.55,34.29 76.2,40.64 66.04,40.64 64.77,41.91 64.77,66.04 67.31,68.58 78.74,68.58 80.01,69.85 Q5.1
RED_SIG_B  (via drill 0.35)
  Top 0.254: Q2.1 121.92,66.04 120.65,64.77 76.2,64.77 71.12,59.69 71.12,51.18 72.77,49.53 78.74,49.53 v81.28,46.99
  Bottom 0.254: v81.28,46.99 90.17,38.1 JP6.7
RELAY_1_3V3
  Top 0.254: IC4.2 52.96,45.72 53.34,45.34 53.34,38.99 54.48,37.85 59.31,37.85 61.91,40.45 61.91,42.67 62.42,43.18 R5.2 63.82,41.59 64.77,40.64 109.22,40.64 110.49,39.37 JP6.15
RELAY_1_5V
  Top 0.254: K1.2 25.45,52.02 43.12,52.02 43.18,52.07 44.45,50.8 44.45,45.72 45.72,44.45 IC4.3
RELAY_2_3V3
  Top 0.254: IC4.5 52.13,41.91 52.56,41.49 52.56,38.56 54.06,37.06 61.51,37.06 62.55,38.1 R4.2 63.82,36.51 64.77,35.56 93.98,35.56 95.25,34.29 JP6.9
RELAY_2_5V
  Top 0.254: K2.2 25.51,24.13 43.31,24.13 44.45,25.27 44.45,39.37 45.72,40.64 IC4.6
RELAY_3_3V3  (via drill 0.35)
  Top 0.254: IC4.9 58.42,40.64 59.69,41.91 59.69,46.99 60.96,48.26 R3.2 63.82,46.67 64.77,45.72 96.52,45.72 97.79,44.45 v97.79,41.91
  Bottom 0.254: v97.79,41.91 JP6.10
RELAY_3_5V
  Top 0.254: K3.2 25.51,80.01 45.72,80.01 47.75,77.98 47.75,52.7 48.77,51.69 52.07,51.69 54.23,49.53 54.23,39.75 54.61,39.37 IC4.8
RST  (via drill 0.35)
  Top 0.254: TFT-INTERFACE.1 120.65,39.37 v115.57,44.45
  Bottom 0.254: v115.57,44.45 105.41,54.61 JP7.13
SCK
  Top 0.254: TFT-INTERFACE.5 96.52,49.53 95.25,50.8 JP7.9
SCL
  Top 0.254: JP7.3 80.01,59.69 82.55,62.23 136.27,62.23 138.3,64.26 138.3,76.07 134.62,79.76 LIGHT-SENSOR.3
SDA
  Top 0.254: LIGHT-SENSOR.4 137.16,79.5 139.83,76.83 139.83,64.14 136.65,60.96 88.9,60.96 87.63,59.69 JP7.6
TACH  (2 unrouted)
TEMP_1
  Bottom 0.254: TEMP-1.1 88.9,78.74 93.98,73.66 96.52,73.66 97.79,72.39 JP7.10
TEMP_2
  Bottom 0.254: JP7.11 100.33,72.39 102.87,74.93 TEMP-2.1

### Text on the board
tPlace: AQUIRE / / GND / / CLOCK / / DATA / / +3.3V | +12V / / GREEN / / RED / / BLUE | SIGNAL / / +3.3V / / GND | SIGNAL / / +3.3V / / GND | +12V / / GREEN / / RED / / BLUE | +3.3V / / GND / / SCL / / SDA | V1.0 | N/O ACT N/C N PASS | GND / / IO-23 / / IO-22 / / TXD-0 (IO-01) / / RXD-0 (IO-03) / / IO-21 / / GND / / IO-19 / / IO-18 / / IO-05 / / IO-17 / / IO-16 / / IO-04 / / IO-00 / / IO-02 / / IO-15 / / SD1 (IO-08) / / SD0 (IO-07) / / CLK (IO-06) | GND / / BACKLIGHT / / +5V / / CLOCK (IO-18) / / DATA IN (IO-23) / / COMMAND (IO-02) / / CHIP SELECT (IO-15) / / RST (IO-04) | ESP32-DevKitC-VE | +3.3V / / EN / / SVP (IO-36) / / SVN (IO-39) / / IO-34 / / IO-35 / / IO-32 / / IO-33 / / IO-25 / / IO-26 / / IO-27 / / IO-14 / / IO-12 / / GND / / IO-13 / / SD2 (IO-09) / / SD3 (IO-10) / / CMD (IO-11) / / +5V | N/O ACT N/C N PASS | TERRARIUM THERMOSTAT | FAN GND / / +12V / / N/C | FAN GND / / +12V / / N/C | FAN GND / / +12V / / N/C | N/O ACT N/C N PASS
bNames: CAUTION 240 VOLT A/C